# Altium schematic sheet ADC.SchDoc: F2837x controlCARD
size 431 x 279 mm; Organization: Texas Instruments; Revision: 1.3
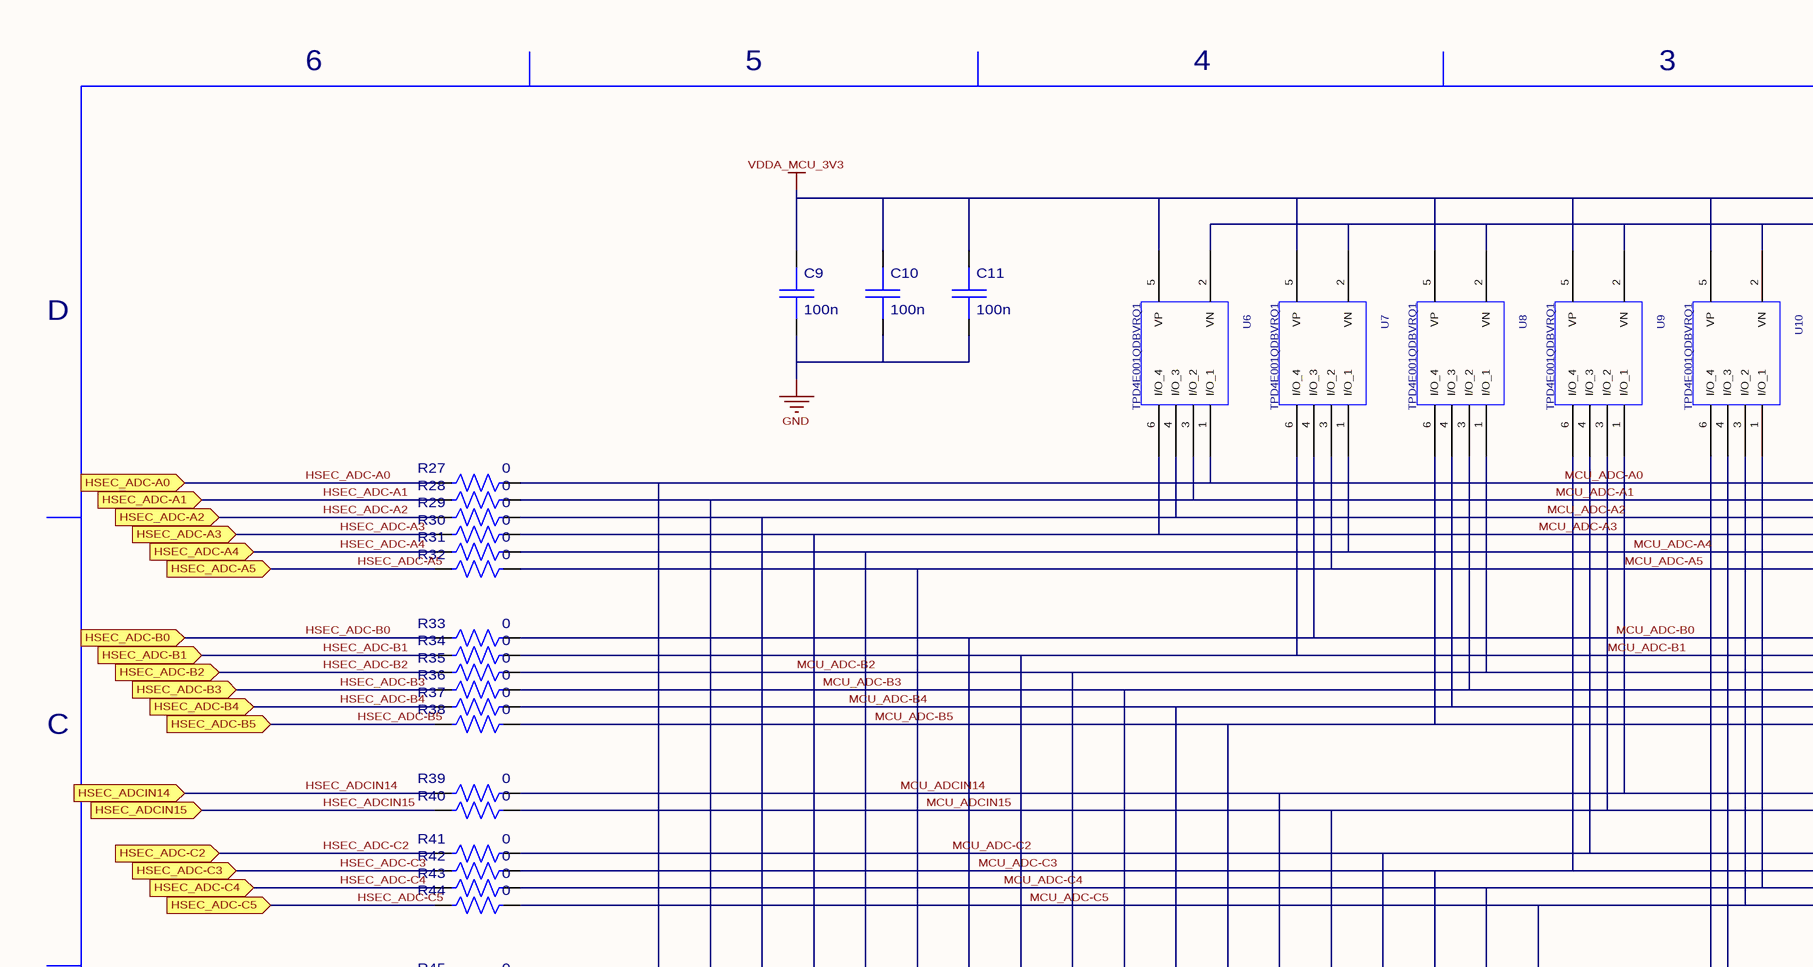
[diagram p0: ADC.SchDoc, top left]
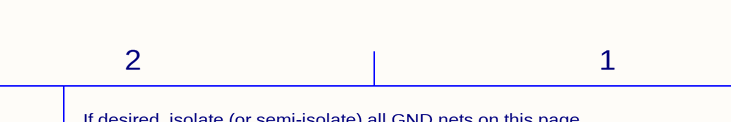
[diagram p1: ADC.SchDoc, top right]
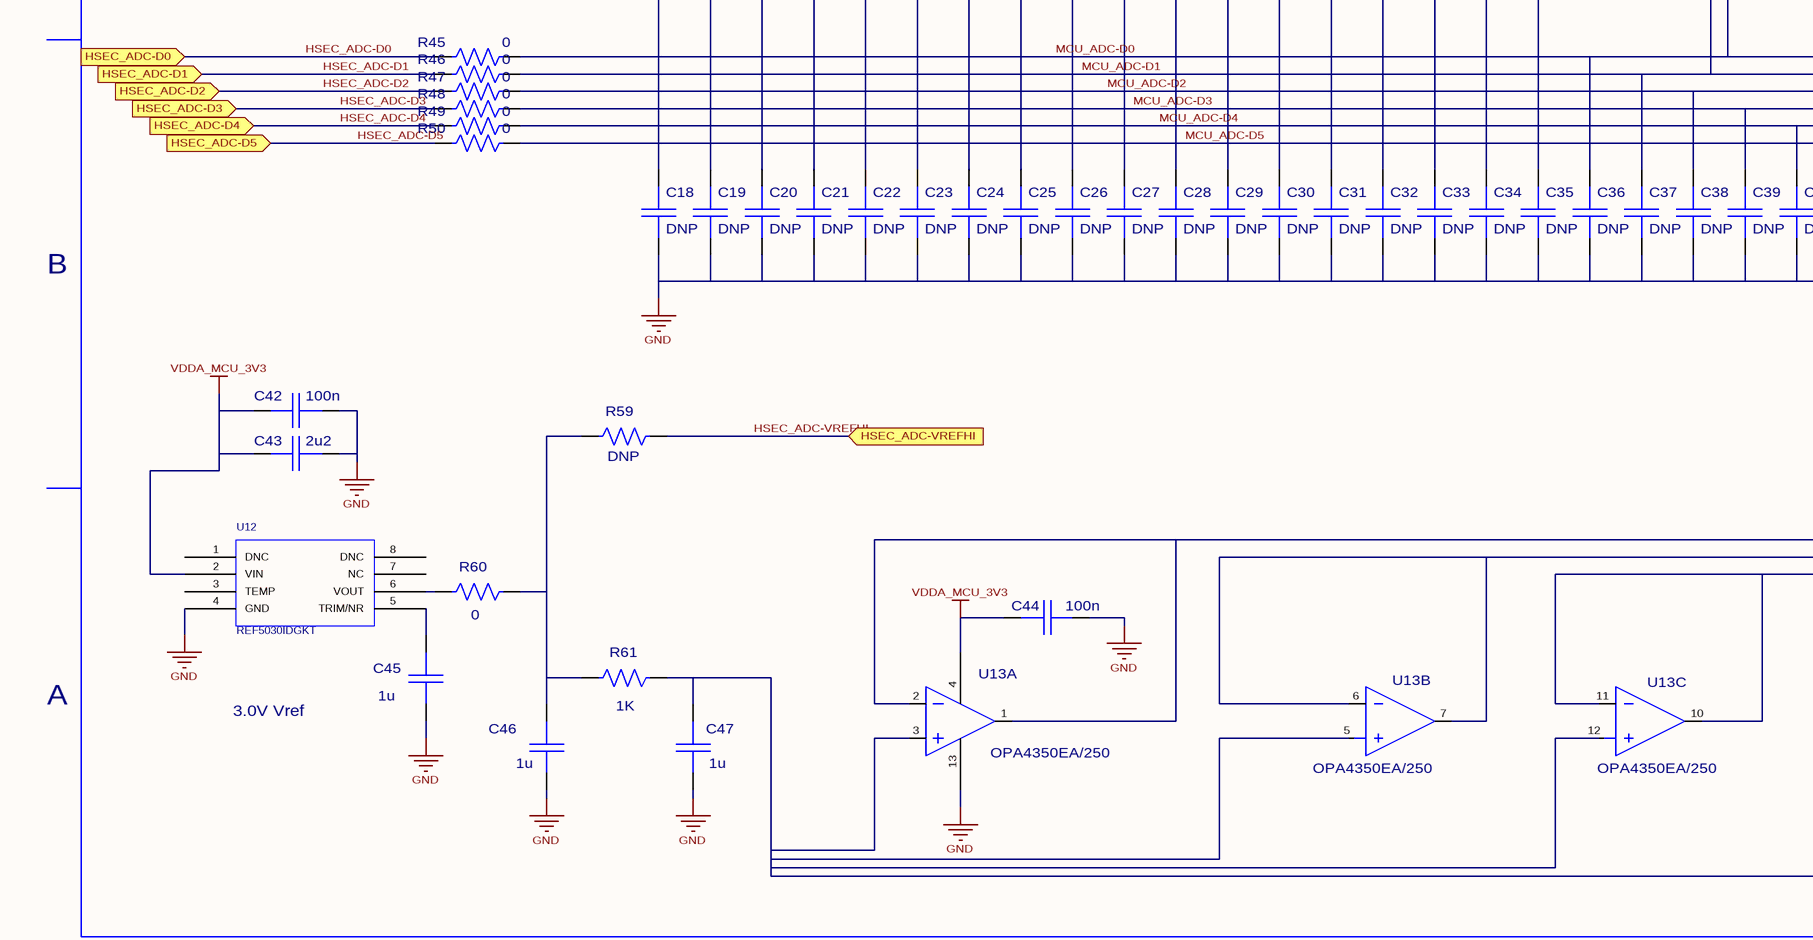
[diagram p2: ADC.SchDoc, bottom left]
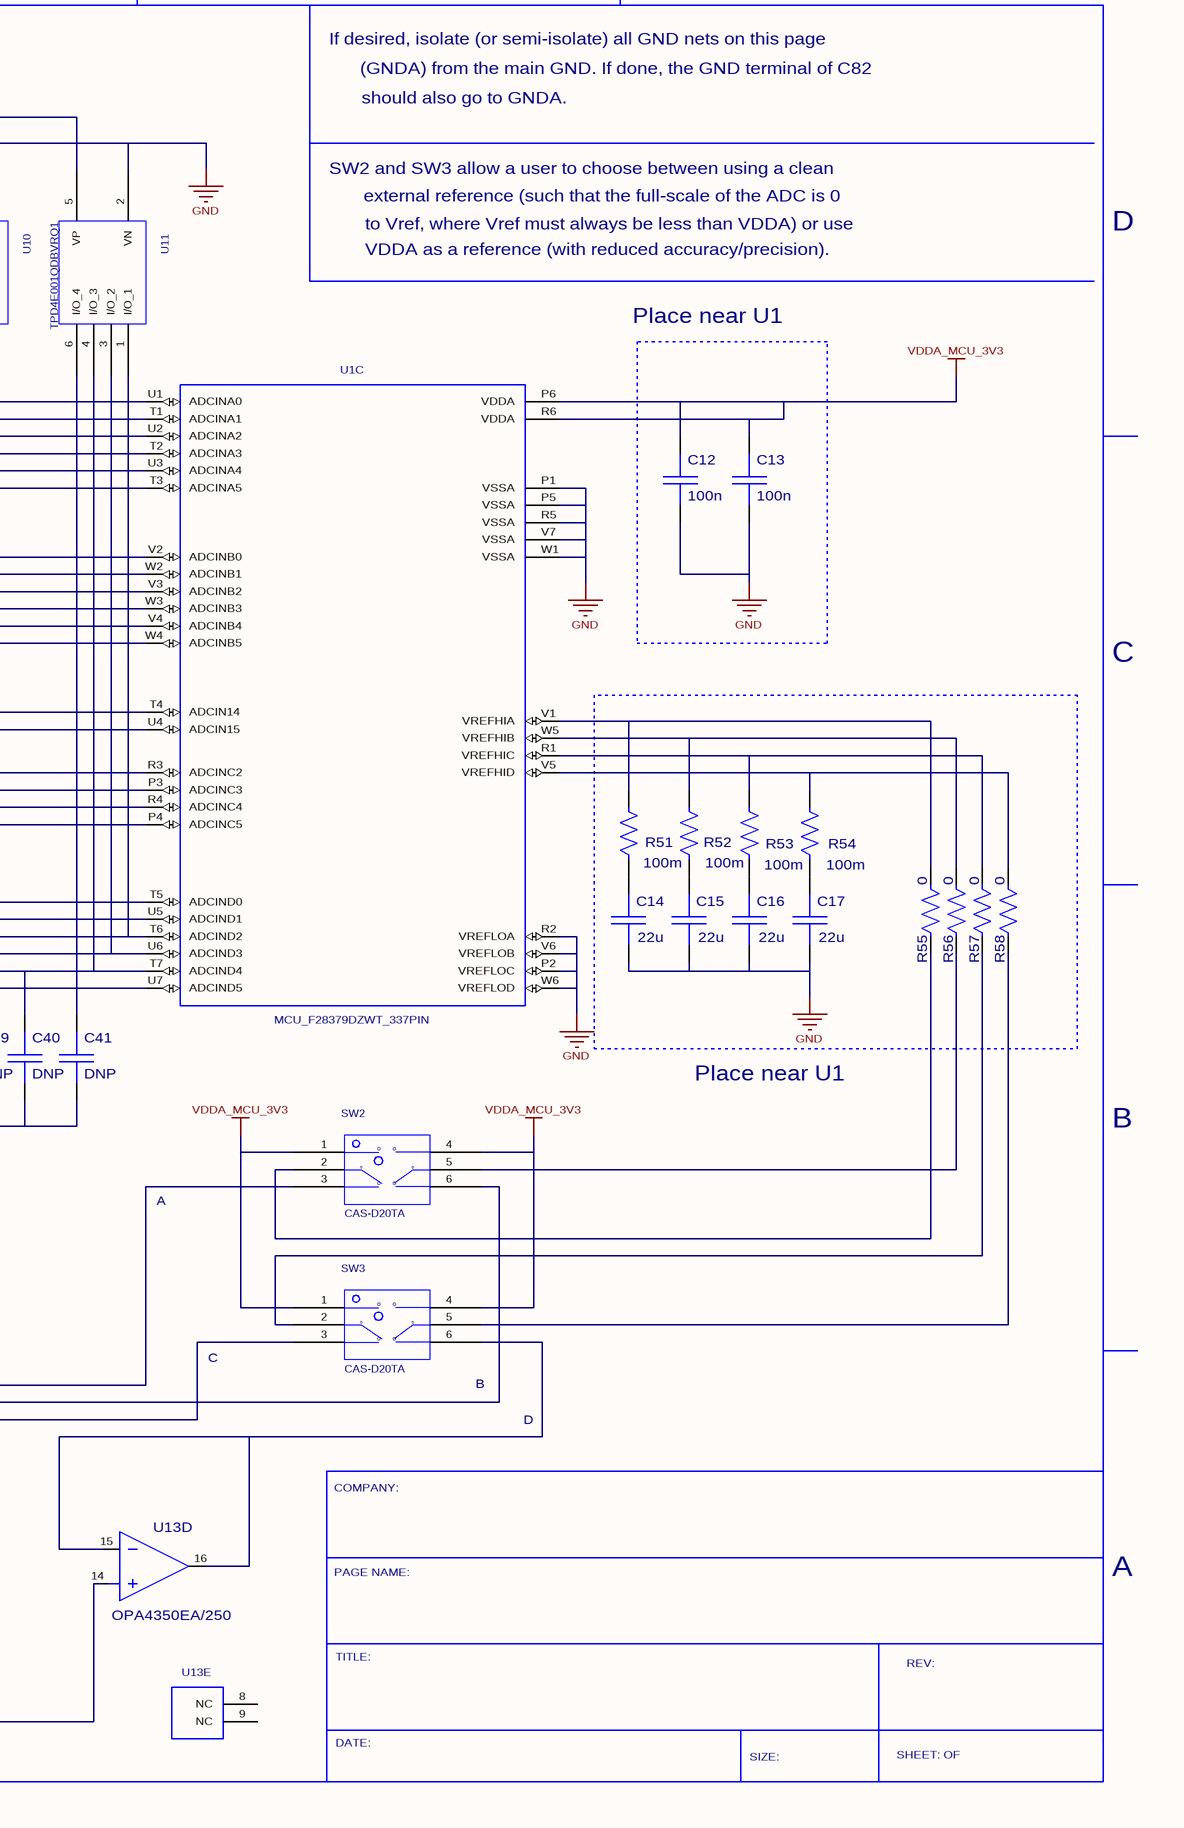
[diagram p3: ADC.SchDoc, bottom right]

## Parts
C9  value 100n  [C0402]  (hidden comment: C0402_16V_X7R)
C10  value 100n  [C0402]  (hidden comment: C0402_16V_X7R)
C11  value 100n  [C0402]  (hidden comment: C0402_16V_X7R)
C12  value 100n  [C0402]  (hidden comment: C0402_16V_X7R)
C13  value 100n  [C0402]  (hidden comment: C0402_16V_X7R)
C14  value 22u  [C0805]  (hidden comment: C0805_16V_X7R)
C15  value 22u  [C0805]  (hidden comment: C0805_16V_X7R)
C16  value 22u  [C0805]  (hidden comment: C0805_16V_X7R)
C17  value 22u  [C0805]  (hidden comment: C0805_16V_X7R)
C18  value DNP  [C0603]  (hidden comment: C0603_16V_X7R)
C19  value DNP  [C0603]  (hidden comment: C0603_16V_X7R)
C20  value DNP  [C0603]  (hidden comment: C0603_16V_X7R)
C21  value DNP  [C0603]  (hidden comment: C0603_16V_X7R)
C22  value DNP  [C0603]  (hidden comment: C0603_16V_X7R)
C23  value DNP  [C0603]  (hidden comment: C0603_16V_X7R)
C24  value DNP  [C0603]  (hidden comment: C0603_16V_X7R)
C25  value DNP  [C0603]  (hidden comment: C0603_16V_X7R)
C26  value DNP  [C0603]  (hidden comment: C0603_16V_X7R)
C27  value DNP  [C0603]  (hidden comment: C0603_16V_X7R)
C28  value DNP  [C0603]  (hidden comment: C0603_16V_X7R)
C29  value DNP  [C0603]  (hidden comment: C0603_16V_X7R)
C30  value DNP  [C0603]  (hidden comment: C0603_16V_X7R)
C31  value DNP  [C0603]  (hidden comment: C0603_16V_X7R)
C32  value DNP  [C0603]  (hidden comment: C0603_16V_X7R)
C33  value DNP  [C0603]  (hidden comment: C0603_16V_X7R)
C34  value DNP  [C0603]  (hidden comment: C0603_16V_X7R)
C35  value DNP  [C0603]  (hidden comment: C0603_16V_X7R)
C36  value DNP  [C0603]  (hidden comment: C0603_16V_X7R)
C37  value DNP  [C0603]  (hidden comment: C0603_16V_X7R)
C38  value DNP  [C0603]  (hidden comment: C0603_16V_X7R)
C39  value DNP  [C0603]  (hidden comment: C0603_16V_X7R)
C40  value DNP  [C0603]  (hidden comment: C0603_16V_X7R)
C41  value DNP  [C0603]  (hidden comment: C0603_16V_X7R)
C42  value 100n  [C0402]  (hidden comment: C0402_16V_X7R)
C43  value 2u2  [C0603]  (hidden comment: C0603_16V_X7R)
C44  value 100n  [C0402]  (hidden comment: C0402_16V_X7R)
C45  value 1u  [C0402]  (hidden comment: C0402_16V_X7R)
C46  value 1u  [C0402]  (hidden comment: C0402_16V_X7R)
C47  value 1u  [C0402]  (hidden comment: C0402_16V_X7R)
R27  value 0  [R0603]  (hidden comment: R0603_5%)
R28  value 0  [R0603]  (hidden comment: R0603_5%)
R29  value 0  [R0603]  (hidden comment: R0603_5%)
R30  value 0  [R0603]  (hidden comment: R0603_5%)
R31  value 0  [R0603]  (hidden comment: R0603_5%)
R32  value 0  [R0603]  (hidden comment: R0603_5%)
R33  value 0  [R0603]  (hidden comment: R0603_5%)
R34  value 0  [R0603]  (hidden comment: R0603_5%)
R35  value 0  [R0603]  (hidden comment: R0603_5%)
R36  value 0  [R0603]  (hidden comment: R0603_5%)
R37  value 0  [R0603]  (hidden comment: R0603_5%)
R38  value 0  [R0603]  (hidden comment: R0603_5%)
R39  value 0  [R0603]  (hidden comment: R0603_5%)
R40  value 0  [R0603]  (hidden comment: R0603_5%)
R41  value 0  [R0603]  (hidden comment: R0603_5%)
R42  value 0  [R0603]  (hidden comment: R0603_5%)
R43  value 0  [R0603]  (hidden comment: R0603_5%)
R44  value 0  [R0603]  (hidden comment: R0603_5%)
R45  value 0  [R0603]  (hidden comment: R0603_5%)
R46  value 0  [R0603]  (hidden comment: R0603_5%)
R47  value 0  [R0603]  (hidden comment: R0603_5%)
R48  value 0  [R0603]  (hidden comment: R0603_5%)
R49  value 0  [R0603]  (hidden comment: R0603_5%)
R50  value 0  [R0603]  (hidden comment: R0603_5%)
R51  value 100m  [R0603]  (hidden comment: R0603_5%)
R52  value 100m  [R0603]  (hidden comment: R0603_5%)
R53  value 100m  [R0603]  (hidden comment: R0603_5%)
R54  value 100m  [R0603]  (hidden comment: R0603_5%)
R55  value 0  [R0402]  (hidden comment: R0402_5%)
R56  value 0  [R0402]  (hidden comment: R0402_5%)
R57  value 0  [R0402]  (hidden comment: R0402_5%)
R58  value 0  [R0402]  (hidden comment: R0402_5%)
R59  value DNP  [R0603]  (hidden comment: R0603_5%)
R60  value 0  [R0603]  (hidden comment: R0603_5%)
R61  value 1K  [R0603]  (hidden comment: R0603_5%)
SW2  value CAS-D20TA  [SWITCH_CAS-D20TA]  (hidden comment: SWITCH_CAS-D20TA)
SW3  value CAS-D20TA  [SWITCH_CAS-D20TA]  (hidden comment: SWITCH_CAS-D20TA)
U1  MCU_F28379DZWT_337PIN  [TI_ZWT_337BGA]  (part C of 5)
U6  TPD4E001QDBVRQ1  [SOT-23-6]
U7  TPD4E001QDBVRQ1  [SOT-23-6]
U8  TPD4E001QDBVRQ1  [SOT-23-6]
U9  TPD4E001QDBVRQ1  [SOT-23-6]
U10  TPD4E001QDBVRQ1  [SOT-23-6]
U11  TPD4E001QDBVRQ1  [SOT-23-6]
U12  value REF5030IDGKT  [MSOP8_DGK]  (hidden comment: IC_REF_REF5030IDGK)
U13  value OPA4350EA/250  [SSOP16_DBQ]  (hidden comment: IC_OPA_OPA4350EA)  (parts A,B,C,D,E of 5)

## Ports
HSEC_ADC-A0, HSEC_ADC-A1, HSEC_ADC-A2, HSEC_ADC-A3, HSEC_ADC-A4, HSEC_ADC-A5, HSEC_ADC-B0, HSEC_ADC-B1, HSEC_ADC-B2, HSEC_ADC-B3, HSEC_ADC-B4, HSEC_ADC-B5, HSEC_ADC-C2, HSEC_ADC-C3, HSEC_ADC-C4, HSEC_ADC-C5, HSEC_ADC-D0, HSEC_ADC-D1, HSEC_ADC-D2, HSEC_ADC-D3, HSEC_ADC-D4, HSEC_ADC-D5, HSEC_ADC-VREFHI, HSEC_ADCIN14, HSEC_ADCIN15

## Nets
GND: C9.1 C10.1 C11.1 C12.1 C13.1 C14.1 C15.1 C16.1 C17.1 C18.1 C19.1 C20.1 C21.1 C22.1 C23.1 C24.1 C25.1 C26.1 C27.1 C28.1 C29.1 C30.1 C31.1 C32.1 C33.1 C34.1 C35.1 C36.1 C37.1 C38.1 C39.1 C40.1 C41.1 C42.2 C43.2 C44.1 C45.1 C46.1 C47.1 U1.P1(VSSA) U1.P2(VREFLOC) U1.P5(VSSA) U1.R2(VREFLOA) U1.R5(VSSA) U1.V6(VREFLOB) U1.V7(VSSA) U1.W1(VSSA) U1.W6(VREFLOD) U6.2(VN) U7.2(VN) U8.2(VN) U9.2(VN) U10.2(VN) U11.2(VN) U12.4(GND) U13.13(V-)
VDDA_MCU_3V3: C9.2 C10.2 C11.2 C12.2 C13.2 C42.1 C43.1 C44.2 SW2.1(A_OUT1) SW2.4(B_IN1) SW3.1(A_OUT1) SW3.4(B_IN1) U1.P6(VDDA) U1.R6(VDDA) U6.5(VP) U7.5(VP) U8.5(VP) U9.5(VP) U10.5(VP) U11.5(VP) U12.2(VIN) U13.4(V+)
HSEC_ADC-A0: R27.1 ; port HSEC_ADC-A0
HSEC_ADC-A1: R28.1 ; port HSEC_ADC-A1
HSEC_ADC-A2: R29.1 ; port HSEC_ADC-A2
HSEC_ADC-A3: R30.1 ; port HSEC_ADC-A3
HSEC_ADC-A4: R31.1 ; port HSEC_ADC-A4
HSEC_ADC-A5: R32.1 ; port HSEC_ADC-A5
HSEC_ADC-B0: R33.1 ; port HSEC_ADC-B0
HSEC_ADC-B1: R34.1 ; port HSEC_ADC-B1
HSEC_ADC-B2: R35.1 ; port HSEC_ADC-B2
HSEC_ADC-B3: R36.1 ; port HSEC_ADC-B3
HSEC_ADC-B4: R37.1 ; port HSEC_ADC-B4
HSEC_ADC-B5: R38.1 ; port HSEC_ADC-B5
HSEC_ADC-C2: R41.1 ; port HSEC_ADC-C2
HSEC_ADC-C3: R42.1 ; port HSEC_ADC-C3
HSEC_ADC-C4: R43.1 ; port HSEC_ADC-C4
HSEC_ADC-C5: R44.1 ; port HSEC_ADC-C5
HSEC_ADC-D0: R45.1 ; port HSEC_ADC-D0
HSEC_ADC-D1: R46.1 ; port HSEC_ADC-D1
HSEC_ADC-D2: R47.1 ; port HSEC_ADC-D2
HSEC_ADC-D3: R48.1 ; port HSEC_ADC-D3
HSEC_ADC-D4: R49.1 ; port HSEC_ADC-D4
HSEC_ADC-D5: R50.1 ; port HSEC_ADC-D5
HSEC_ADC-VREFHI: R59.2 ; port HSEC_ADC-VREFHI
HSEC_ADCIN14: R39.1 ; port HSEC_ADCIN14
HSEC_ADCIN15: R40.1 ; port HSEC_ADCIN15
MCU_ADC-A0: C18.2 R27.2 U1.U1(ADCINA0) U6.1(I/O_1)
MCU_ADC-A1: C19.2 R28.2 U1.T1(ADCINA1) U6.3(I/O_2)
MCU_ADC-A2: C20.2 R29.2 U1.U2(ADCINA2) U6.4(I/O_3)
MCU_ADC-A3: C21.2 R30.2 U1.T2(ADCINA3) U6.6(I/O_4)
MCU_ADC-A4: C22.2 R31.2 U1.U3(ADCINA4) U7.1(I/O_1)
MCU_ADC-A5: C23.2 C30.2 R32.2 R39.2 U1.T3(ADCINA5) U1.T4(ADCIN14) U7.3(I/O_2) U9.1(I/O_1)  [also labelled MCU_ADCIN14]
MCU_ADC-B0: C24.2 R33.2 U1.V2(ADCINB0) U7.4(I/O_3)
MCU_ADC-B1: C25.2 C31.2 R34.2 R40.2 U1.U4(ADCIN15) U1.W2(ADCINB1) U7.6(I/O_4) U9.3(I/O_2)  [also labelled MCU_ADCIN15]
MCU_ADC-B2: C26.2 R35.2 U1.V3(ADCINB2) U8.1(I/O_1)
MCU_ADC-B3: C27.2 R36.2 U1.W3(ADCINB3) U8.3(I/O_2)
MCU_ADC-B4: C28.2 R37.2 U1.V4(ADCINB4) U8.4(I/O_3)
MCU_ADC-B5: C29.2 R38.2 U1.W4(ADCINB5) U8.6(I/O_4)
MCU_ADC-C2: C32.2 R41.2 U1.R3(ADCINC2) U9.4(I/O_3)
MCU_ADC-C3: C33.2 R42.2 U1.P3(ADCINC3) U9.6(I/O_4)
MCU_ADC-C4: C34.2 R43.2 U1.R4(ADCINC4) U10.1(I/O_1)
MCU_ADC-C5: C35.2 R44.2 U1.P4(ADCINC5) U10.3(I/O_2)
MCU_ADC-D0: C36.2 R45.2 U1.T5(ADCIND0) U10.4(I/O_3)
MCU_ADC-D1: C37.2 R46.2 U1.U5(ADCIND1) U10.6(I/O_4)
MCU_ADC-D2: C38.2 R47.2 U1.T6(ADCIND2) U11.1(I/O_1)
MCU_ADC-D3: C39.2 R48.2 U1.U6(ADCIND3) U11.3(I/O_2)
MCU_ADC-D4: C40.2 R49.2 U1.T7(ADCIND4) U11.4(I/O_3)
MCU_ADC-D5: C41.2 R50.2 U1.U7(ADCIND5) U11.6(I/O_4)
NetC14_2: C14.2 R51.1
NetC15_2: C15.2 R52.1
NetC16_2: C16.2 R53.1
NetC17_2: C17.2 R54.1
NetC45_2: C45.2 U12.5(TRIM/NR)
NetC46_2: C46.2 R59.1 R60.2 R61.2
NetC47_2: C47.2 R61.1 U13.3(+A) U13.5(+B) U13.12(+C) U13.14(+D)
NetR51_2: R51.2 R55.2 U1.V1(VREFHIA)
NetR52_2: R52.2 R56.2 U1.W5(VREFHIB)
NetR53_2: R53.2 R57.2 U1.R1(VREFHIC)
NetR54_2: R54.2 R58.2 U1.V5(VREFHID)
NetR55_1: R55.1 SW2.2(A_IN)
NetR56_1: R56.1 SW2.5(B_IN)
NetR57_1: R57.1 SW3.2(A_IN)
NetR58_1: R58.1 SW3.5(B_IN)
NetR60_1: R60.1 U12.6(VOUT)
NetSW2_3: SW2.3(A_OUT2) U13.1(OUTA) U13.2(-A)
NetSW2_6: SW2.6(B_IN2) U13.6(-B) U13.7(OUTB)
NetSW3_3: SW3.3(A_OUT2) U13.10(OUTC) U13.11(-C)
NetSW3_6: SW3.6(B_IN2) U13.15(-D) U13.16(OUTD)

Not connected (* = marked no-connect by the designer): U12 1(DNC) 3(TEMP) 7(NC) 8(DNC); U13 8(NC) 9(NC)

## Notes on the sheet
- 6
- 5
- 4
- 3
- If desired, isolate (or semi-isolate) all GND nets on this page
- 2
- 1
- (GNDA) from the main GND. If done, the GND terminal of C82
- should also go to GNDA.
- SW2 and SW3 allow a user to choose between using a clean
- external reference (such that the full-scale of the ADC is 0
- to Vref, where Vref must always be less than VDDA) or use
- D
- VDDA as a reference (with reduced accuracy/precision).
- Place near U1
- C
- B
- A
- (near SW3) B
- COMPANY:
- 3.0V Vref
- PAGE NAME:
- TITLE:
- REV:
- DATE:
- SIZE:
- SHEET: OF
- (in symbol SWITCH_CAS-D20TA) o

## Library data of the parts
C9-C13 C42 C44 = C0402_16V_X7R: CAP CER 16V 10% X7R 0402; Decal: C0402; PCB DECAL: C0402
C14-C17 = C0805_16V_X7R: CAP CER 10V 20% X5R/X7S 0805; Decal: C0805; PCB DECAL: C0805
C18-C41 = C0603_16V_X7R: CAP CER 16V 10% X7R 0603; Decal: C0603; PCB DECAL: C0603
C43 = C0603_16V_X7R: CAP CER 10V 20% X5R 0603; Decal: C0603; PCB DECAL: C0603
C45-C47 = C0402_16V_X7R: CAP CER 6.3V 10% X7R 0402; Decal: C0402; PCB DECAL: C0402
R27-R54 R59-R61 = R0603_5%: RES 1/10W 5% 0603 SMD; Decal: R0603; PCB DECAL: R0603
R55-R58 = R0402_5%: RES 1/16W 5% 0402 SMD; Decal: R0402; PCB DECAL: R0402
SW2 SW3 = SWITCH_CAS-D20TA: Switch SPDT, 2 position; Manufacturer: Copal Electronics; Decal: SW-CAS-D20TA; Digikey: CASD20JCT-ND; Height: 2.5 (mm); Part Number: CAS-D20TA; Size: 5.4 L x 4.2 W, 1.75 LS (mm); PCB DECAL: SWITCH_CAS-D20TA
U1 = MCU_F28379DZWT_337PIN: MCU F2837x 337pin ZWT BGA; Part Number: TMS320F28379DZWT; Decal: TI_ZWT_337BGA; PCB DECAL: TI_ZWT_337BGA
U6-U11 = TPD4E001QDBVRQ1: TVS 4-ch UniDir Diode Array: VCC & GND prot, 11V brkdwn; Manufacturer: Texas Instruments; Decal: SOT-23-6; Digikey: 296-39344-1-ND; Part Number: TPD4E001QDBVRQ1; Value: TPD4E001QDBVRQ1; PCB DECAL: SOT-23-6
U12 = IC_REF_REF5030IDGK: IC, 3.0V Vref, 0.05%, 8DGK; Decal: MSOP8_DGK; Digikey: 296-24501-1-ND; Part Number: REF5030IDGKT; PCB DECAL: MSOP8_DGK
U13 = IC_OPA_OPA4350EA: IC OPAMP GP R-R 38MHZ QUAD 16DBQ; Decal: SSOP16-DBQ; Digikey: OPA4350EACT-ND; Part Number: OPA4350EA/250; PCB DECAL: SSOP16_DBQ